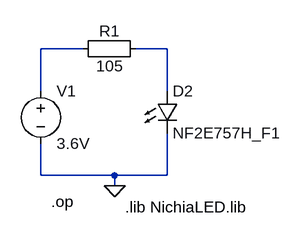
[diagram p0: schematic LED-OP-1.asc]
LED-OP-1.asc, the LTspice schematic file:
Version 4
SHEET 1 880 680
WIRE 0 160 -64 160
WIRE 128 160 80 160
WIRE -64 224 -64 160
WIRE 128 224 128 160
WIRE -64 352 -64 304
WIRE 48 352 -64 352
WIRE 128 352 128 288
WIRE 128 352 48 352
WIRE 48 368 48 352
FLAG 48 368 0
SYMBOL LED 112 224 R0
SYMATTR InstName D2
SYMATTR Value NF2E757H_F1
SYMBOL voltage -64 208 R0
SYMATTR InstName V1
SYMATTR Value 3.6V
SYMBOL Misc\\EuropeanResistor 96 144 R90
WINDOW 0 5 56 VBottom 2
WINDOW 3 27 56 VTop 2
SYMATTR InstName R1
SYMATTR Value 105
TEXT 64 400 Left 2 !.lib NichiaLED.lib
TEXT -48 392 Left 2 !.op

The netlist it stands for:
* LED-OP-1.asc
D2 N002 0 NF2E757H_F1
V1 N001 0 3.6V
R1 N002 N001 105
.model D D
.lib standard.dio
.lib NichiaLED.lib
.op
.backanno
.end